# Altium schematic sheet St3025_Servo_Schematic.SchDoc
size A4; DocumentNumber: 3; SheetNumber: 3; SheetTotal: 6
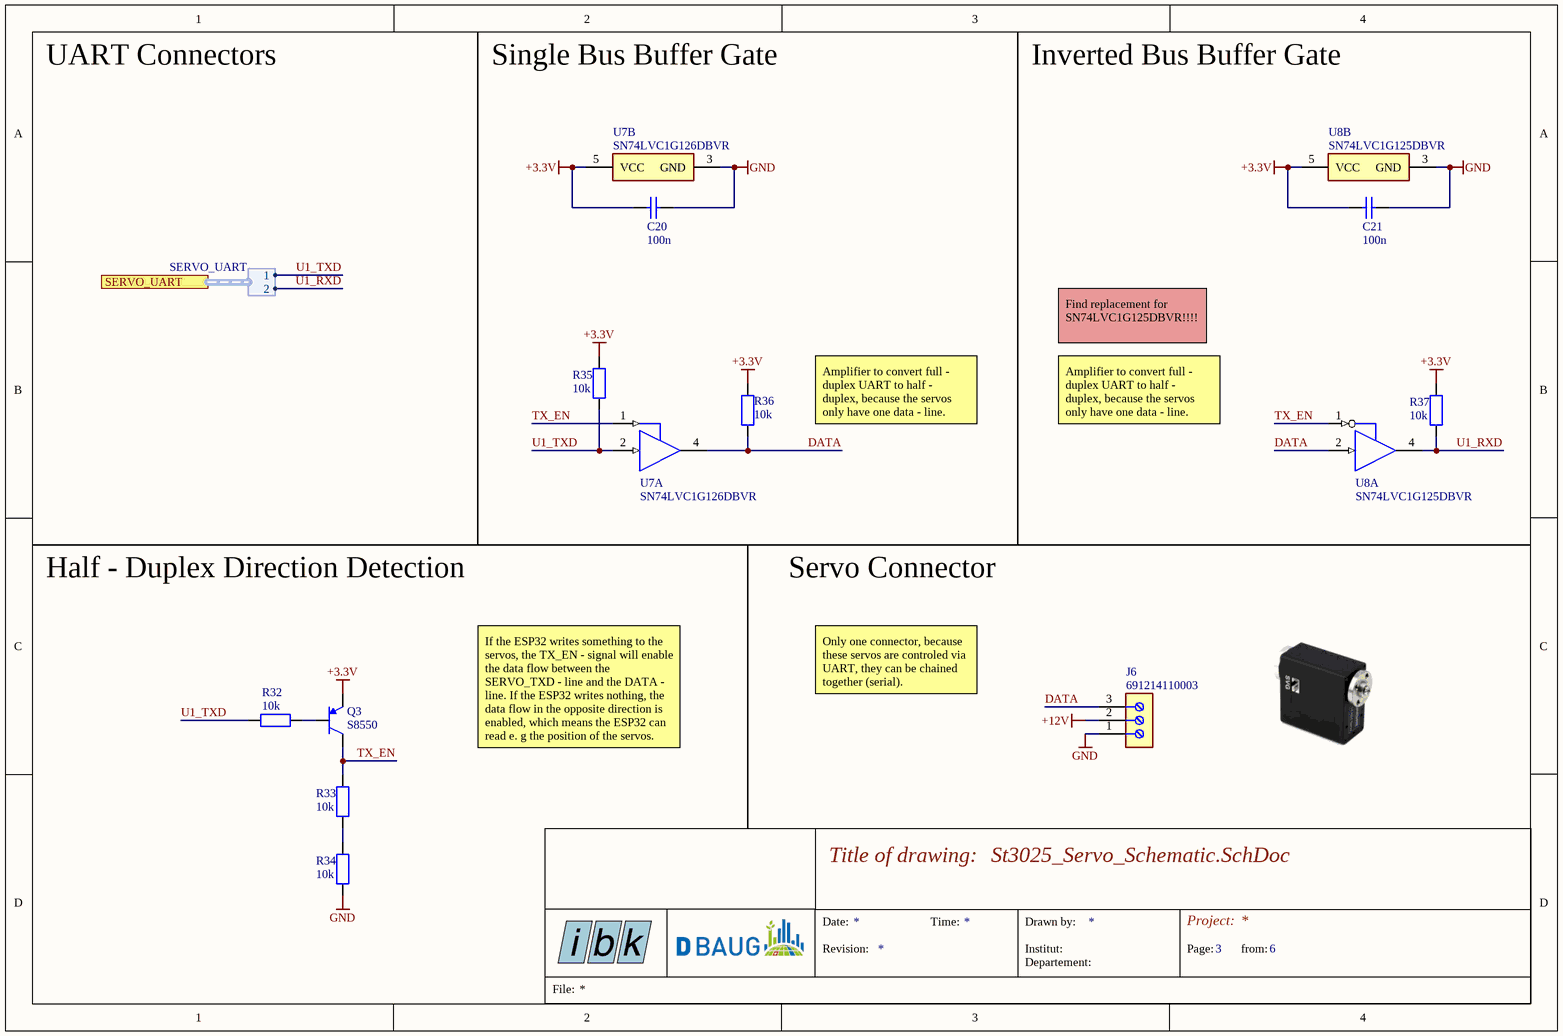
[diagram p0: St3025_Servo_Schematic.SchDoc]

## Parts
C20  100n  [0603_CAPACITOR]
C21  100n  [0603_CAPACITOR]
J6  691214110003  [Screw_Connector]
Q3  S8550  [PNP_Bipolar_Transistor]
R32  10k  [0603_Resistor]
R33  10k  [0603_Resistor]
R34  10k  [0603_Resistor]
R35  10k  [0603_Resistor]
R36  10k  [0603_Resistor]
R37  10k  [0603_Resistor]
U7  SN74LVC1G126DBVR  [DBV0005A_L_Single_Bus_Buffer_Gate]  (parts A,B of 2)
U8  SN74LVC1G125DBVR  [DBV0005A_L_Single_Bus_Buffer_Gate]  (parts A,B of 2)

## Ports
SERVO_UART (harness SERVO_UART)

## Harnesses
SERVO_UART: 1, 2

## Nets
+3.3V: C20.2 C21.2 Q3.2(E) R35.2 R36.2 R37.2 U7.5(VCC) U8.5(VCC)
+12V: J6.2
GND: C20.1 C21.1 J6.1 R34.1 U7.3(GND) U8.3(GND)
DATA: J6.3 R36.1 U7.4(Y) U8.2(A)
TX_EN: Q3.3(C) R33.2 U7.1(OE) U8.1(OE)
U1_RXD: R37.1 U8.4(Y) ; port SERVO_UART.2
U1_TXD: R32.2 R35.1 U7.2(A) ; port SERVO_UART.1
NetQ3_1: Q3.1(B) R32.1
NetR33_1: R33.1 R34.2

## Notes on the sheet
- UART Connectors
- Single Bus Buffer Gate
- Inverted Bus Buffer Gate
- Find replacement for SN74LVC1G125DBVR!!!!
- Amplifier to convert full - duplex UART to half - duplex, because the servos only have one data - line.
- Half - Duplex Direction Detection
- Servo Connector
- Only one connector, because these servos are controled via UART, they can be chained together (serial).
- If the ESP32 writes something to the servos, the TX_EN - signal will enable the data flow between the SERVO_TXD - line and the DATA - line. If the ESP32 writes nothing, the data flow in the opposite direction is enabled, which means the ESP32 can read e. g the position of the servos.
- Date:
- Title of drawing:
- Time:
- Drawn by:
- Project:
- Revision:
- Institut:
- Departement:
- Page:
- from:
- File:

## Library data of the parts
C20 C21 = Capacitor: 0603
J6 = Screw_Connector: 691214110003 Wurth Elektronik
Q3 = PNP_Bipolar_Transistor: Bipolar (BJT) Transistor PNP 25 V 500 mA 150MHz 300 mW Surface Mount SOT-23.
R32-R37 = Resistor: 0603
U7 = Single_Bus_Buffer_Gate: Single Bus Buffer Gate With 3-State Outputs, DBV0005A, LARGE T&R.; ComponentLink1Description: Supplier; ComponentLink1URL: https://www.digikey.com/en/products/detail/texas-instruments/SN74LVC1G126DBVR/385722
U8 = Single_Bus_Buffer_Gate_Inverted: Single Bus Buffer Gate With 3-State Outputs, DBV0005A, LARGE T&R.; ComponentLink1Description: Supplier; ComponentLink1URL: *